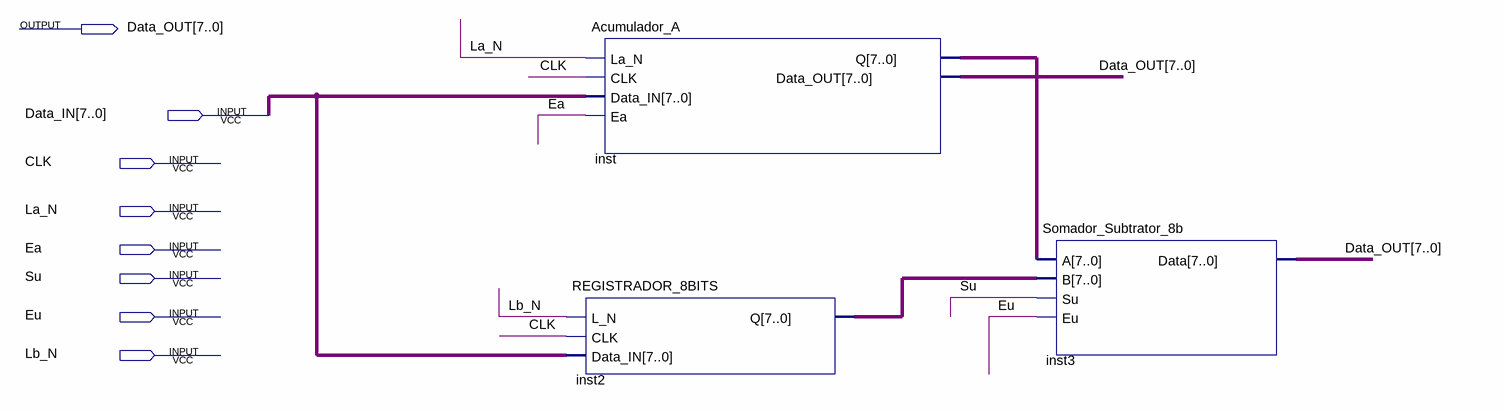
[diagram p0: schematic sheet]
// Quartus schematic ULA.bdf as structural Verilog: 3 symbols, 8 pins
module ULA (
  input  [7:0] Data_IN,
  input  CLK,
  input  La_N,
  input  Ea,
  input  Su,
  input  Eu,
  input  Lb_N,
  output [7:0] Data_OUT
);

  wire [7:0] inst2_q, inst_q;

  Acumulador_A inst (.La_N(La_N), .CLK(CLK), .Data_IN(Data_IN), .Ea(Ea), .Q(inst_q), .Data_OUT(Data_OUT));
  REGISTRADOR_8BITS inst2 (.L_N(Lb_N), .CLK(CLK), .Data_IN(Data_IN), .Q(inst2_q));
  Somador_Subtrator_8b inst3 (.A(inst_q), .B(inst2_q), .Su(Su), .Eu(Eu), .Data(Data_OUT));
endmodule
